# Altium schematic sheet CVTOP.SchDoc
size A3
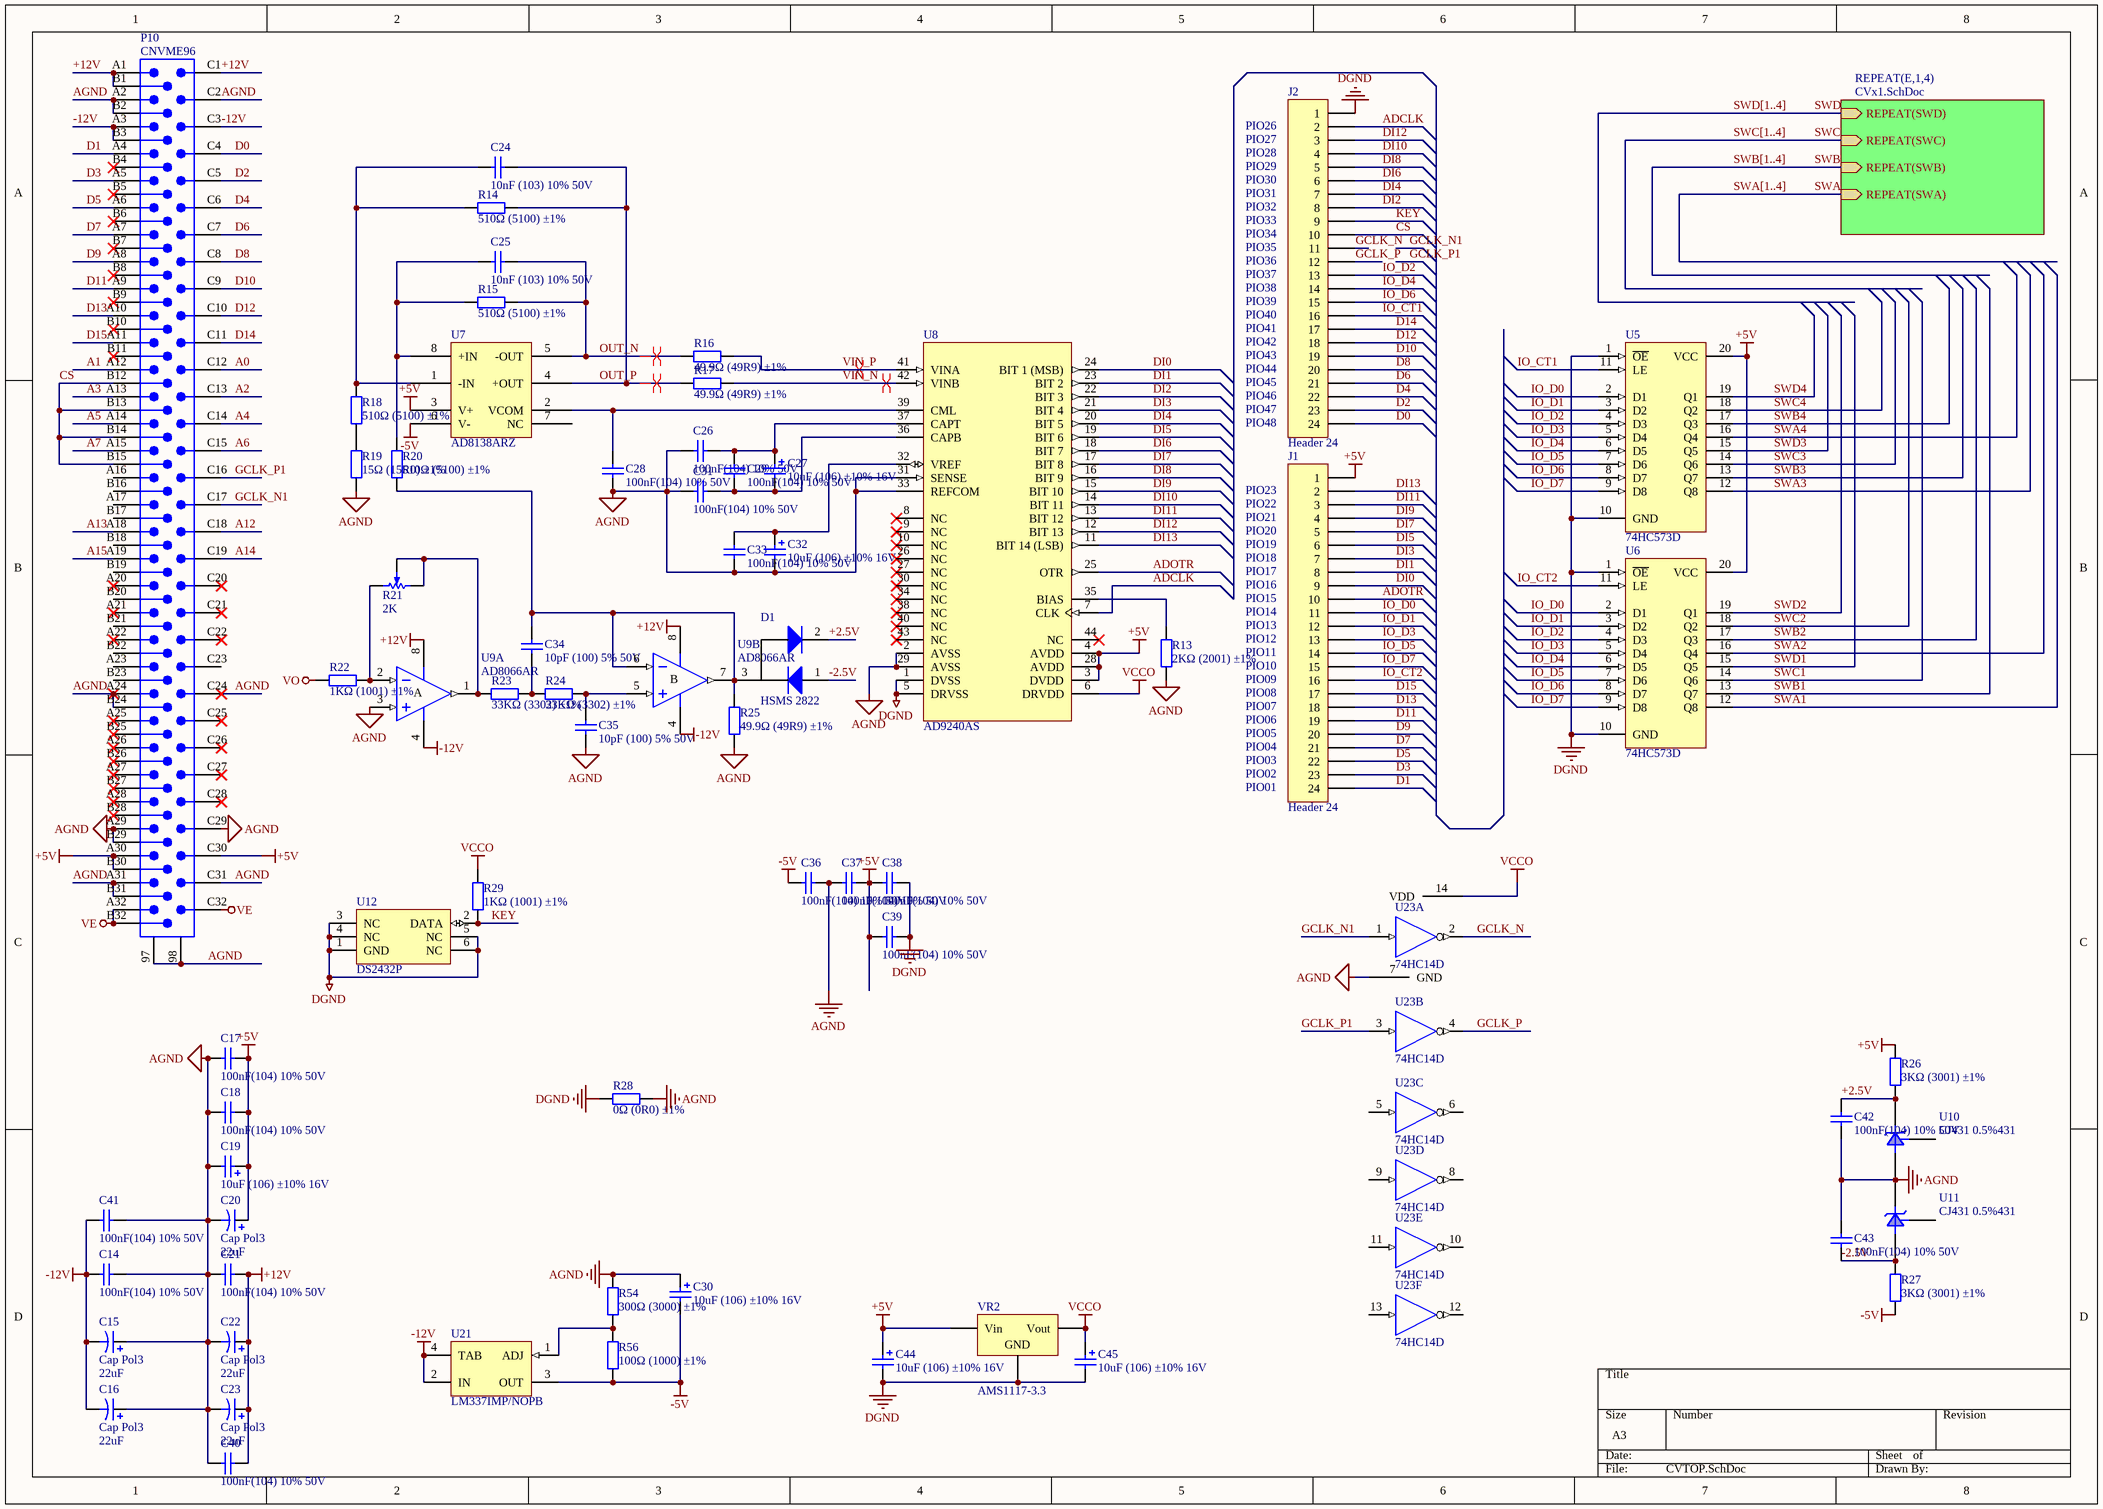
[diagram p0: CVTOP.SchDoc]

## Parts
C14  100nF(104) 10% 50V  [LC-0805_C]
C15  Cap Pol3  value 22uF  [C2225]
C16  Cap Pol3  value 22uF  [C2225]
C17  100nF(104) 10% 50V  [LC-0805_C]
C18  100nF(104) 10% 50V  [LC-0805_C]
C19  10uF (106) ±10% 16V  [LC-CASE-A_3216]
C20  Cap Pol3  value 22uF  [C2225]
C21  100nF(104) 10% 50V  [LC-0805_C]
C22  Cap Pol3  value 22uF  [C2225]
C23  Cap Pol3  value 22uF  [C2225]
C24  10nF (103) 10% 50V  [LC-0805_C]
C25  10nF (103) 10% 50V  [LC-0805_C]
C26  100nF(104) 10% 50V  [LC-0805_C]
C27  10uF (106) ±10% 16V  [LC-CASE-A_3216]
C28  100nF(104) 10% 50V  [LC-0805_C]
C29  100nF(104) 10% 50V  [LC-0805_C]
C30  10uF (106) ±10% 16V  [LC-CASE-A_3216]
C31  100nF(104) 10% 50V  [LC-0805_C]
C32  10uF (106) ±10% 16V  [LC-CASE-A_3216]
C33  100nF(104) 10% 50V  [LC-0805_C]
C34  10pF (100) 5% 50V  [LC-0805_C]
C35  10pF (100) 5% 50V  [LC-0805_C]
C36  100nF(104) 10% 50V  [LC-0805_C]
C37  100nF(104) 10% 50V  [LC-0805_C]
C38  100nF(104) 10% 50V  [LC-0805_C]
C39  100nF(104) 10% 50V  [LC-0805_C]
C40  100nF(104) 10% 50V  [LC-0805_C]
C41  100nF(104) 10% 50V  [LC-0805_C]
C42  100nF(104) 10% 50V  [LC-0805_C]
C43  100nF(104) 10% 50V  [LC-0805_C]
C44  10uF (106) ±10% 16V  [LC-CASE-A_3216]
C45  10uF (106) ±10% 16V  [LC-CASE-A_3216]
D1  HSMS 2822  [LC-SOT-23(SOT-23-3)]
J1  Header 24  [HDR1X24]
J2  Header 24  [HDR1X24]
P10  CNVME96  [CNVME96]
R13  2KΩ (2001) ±1%  [LC-0805_R]
R14  510Ω (5100) ±1%  [LC-0805_R]
R15  510Ω (5100) ±1%  [LC-0805_R]
R16  49.9Ω (49R9) ±1%  [LC-0805_R]
R17  49.9Ω (49R9) ±1%  [LC-0805_R]
R18  510Ω (5100) ±1%  [LC-0805_R]
R19  15Ω (15R0) ±1%  [LC-0805_R]
R20  510Ω (5100) ±1%  [LC-0805_R]
R21  2K  [POT4MM-2]
R22  1KΩ (1001) ±1%  [LC-0805_R]
R23  33KΩ (3302) ±1%  [LC-0805_R]
R24  33KΩ (3302) ±1%  [LC-0805_R]
R25  49.9Ω (49R9) ±1%  [LC-0805_R]
R26  3KΩ (3001) ±1%  [LC-0805_R]
R27  3KΩ (3001) ±1%  [LC-0805_R]
R28  0Ω (0R0) ±1%  [LC-0805_R]
R29  1KΩ (1001) ±1%  [LC-0805_R]
R54  300Ω (3000) ±1%  [LC-0805_R]
R56  100Ω (1000) ±1%  [LC-0805_R]
U5  74HC573D  [LC-SOIC-20_300mil]
U6  74HC573D  [LC-SOIC-20_300mil]
U7  AD8138ARZ  [SO-8_N]
U8  AD9240AS  [S-44-MQFP_N]
U9  AD8066AR  [SO-8_N]  (parts A,B of 2)
U10  CJ431 0.5%431  [LC-SOT-23(SOT-23-3)]
U11  CJ431 0.5%431  [LC-SOT-23(SOT-23-3)]
U12  DS2432P  [TSOC6]
U21  LM337IMP/NOPB  [MP04A_N]
U23  74HC14D  [LC-SOIC-14_150mil]  (parts A,B,C,D,E,F of 6)
VR2  AMS1117-3.3  [LC-SOT-223]

## Sub-sheets
REPEAT(E,1,4) = CVx1.SchDoc: REPEAT(SWC) (in), REPEAT(SWB) (in), REPEAT(SWD) (in), REPEAT(SWA) (in)

## Nets
+5V: C17.2 C18.2 C19.1 C20.1 C37.1 C38.2 C39.2 C44.1 J1.1 P10.A30 P10.B30 P10.C30 R26.2 U5.20(VCC) U6.20(VCC) U7.3(V+) U8.3(DVDD) U8.4(AVDD) U8.28(AVDD) VR2.3(Vin)
+12V: C21.2 C22.1 C23.1 C40.1 P10.A1 P10.B1 P10.C1 U9.8(V+)
-5V: C30.2 C36.2 R27.1 R56.1 U7.6(V-) U21.3(OUT)
-12V: C14.1 C15.2 C16.2 C41.2 P10.A3 P10.B3 P10.C3 U9.4(V-) U21.2(IN) U21.4(TAB)
AGND: C14.2 C15.1 C16.1 C17.1 C18.1 C19.2 C20.2 C21.1 C22.2 C23.2 C26.2 C28.1 C30.1 C31.2 C32.2 C33.1 C35.1 C36.1 C37.2 C40.2 C41.1 C42.2 C43.1 P10.97 P10.98 P10.A2 P10.A24 P10.A29 P10.A31 P10.B2 P10.B24 P10.B29 P10.B31 P10.C2 P10.C24 P10.C29 P10.C31 R13.1 R19.1 R25.1 R28.2 R54.2 U8.2(AVSS) U8.29(AVSS) U8.31(SENSE) U8.33(REFCOM) U9.3(IN+) U10.3(A) U11.2(K) U23.7(GND)
DGND: C38.1 C39.1 C44.2 C45.2 J2.1 R28.1 U5.1(~{OE}) U5.10(GND) U6.1(~{OE}) U6.10(GND) U8.1(DVSS) U8.5(DRVSS) U12.1(GND) U12.3(NC) U12.4(NC) U12.5(NC) U12.6(NC) VR2.1(GND)
VCCO: C45.1 R29.2 U8.6(DRVDD) U23.14(VDD) VR2.2(Vout)
VE: P10.A32 P10.B32 P10.C32
VO: R22.1
+2.5V: C42.1 D1.2(A) R26.1 U10.2(K)
-2.5V: C43.2 D1.1(A) R27.2 U11.3(A)
A0: P10.C12
A1: P10.A12
A2: P10.C13
A3: P10.A13
A4: P10.C14
A5: P10.A14
A6: P10.C15
A7: P10.A15
A12: P10.C18
A13: P10.A18
A14: P10.C19
A15: P10.A19
ADCLK: J2.2 U8.7(CLK)
ADOTR: J1.10 U8.25(OTR)
CS: J2.10 P10.B12 P10.B13 P10.B14 P10.B15
D0: J2.24 P10.C4
D1: J1.24 P10.A4
D2: J2.23 P10.C5
D3: J1.23 P10.A5
D4: J2.22 P10.C6
D5: J1.22 P10.A6
D6: J2.21 P10.C7
D7: J1.21 P10.A7
D8: J2.20 P10.C8
D9: J1.20 P10.A8
D10: J2.19 P10.C9
D11: J1.19 P10.A9
D12: J2.18 P10.C10
D13: J1.18 P10.A10
D14: J2.17 P10.C11
D15: J1.17 P10.A11
DI0: J1.9 U8.24(BIT_1_(MSB))
DI1: J1.8 U8.23(BIT_2)
DI2: J2.8 U8.22(BIT_3)
DI3: J1.7 U8.21(BIT_4)
DI4: J2.7 U8.20(BIT_5)
DI5: J1.6 U8.19(BIT_6)
DI6: J2.6 U8.18(BIT_7)
DI7: J1.5 U8.17(BIT_8)
DI8: J2.5 U8.16(BIT_9)
DI9: J1.4 U8.15(BIT_10)
DI10: J2.4 U8.14(BIT_11)
DI11: J1.3 U8.13(BIT_12)
DI12: J2.3 U8.12(BIT_13)
DI13: J1.2 U8.11(BIT_14_(LSB))
GCLK_N: J2.11 U23.2(Y)
GCLK_N1: P10.C17 U23.1(A)
GCLK_P: J2.12 U23.4(Y)
GCLK_P1: P10.C16 U23.3(A)
IO_CT1: J2.16 U5.11(LE)
IO_CT2: J1.16 U6.11(LE)
IO_D0: J1.11 U5.2(D1) U6.2(D1)
IO_D1: J1.12 U5.3(D2) U6.3(D2)
IO_D2: J2.13 U5.4(D3) U6.4(D3)
IO_D3: J1.13 U5.5(D4) U6.5(D4)
IO_D4: J2.14 U5.6(D5) U6.6(D5)
IO_D5: J1.14 U5.7(D6) U6.7(D6)
IO_D6: J2.15 U5.8(D7) U6.8(D7)
IO_D7: J1.15 U5.9(D8) U6.9(D8)
KEY: J2.9 R29.1 U12.2(DATA)
OUT_N: C25.2 R15.2 R16.1 U7.5(-OUT)
OUT_P: C24.2 R14.2 R17.1 U7.4(+OUT)
SWA: sheet REPEAT(E,1,4)/REPEAT(SWA)
SWA1: U6.12(Q8)
SWA2: U6.16(Q4)
SWA3: U5.12(Q8)
SWA4: U5.16(Q4)
SWB: sheet REPEAT(E,1,4)/REPEAT(SWB)
SWB1: U6.13(Q7)
SWB2: U6.17(Q3)
SWB3: U5.13(Q7)
SWB4: U5.17(Q3)
SWC: sheet REPEAT(E,1,4)/REPEAT(SWC)
SWC1: U6.14(Q6)
SWC2: U6.18(Q2)
SWC3: U5.14(Q6)
SWC4: U5.18(Q2)
SWD: sheet REPEAT(E,1,4)/REPEAT(SWD)
SWD1: U6.15(Q5)
SWD2: U6.19(Q1)
SWD3: U5.15(Q5)
SWD4: U5.19(Q1)
VIN_N: R17.2 U8.42(VINB)
VIN_P: R16.2 U8.41(VINA)
NetC24_1: C24.1 R14.1 R18.2 U7.1(-IN)
NetC25_1: C25.1 R15.1 R20.2 U7.8(+IN)
NetC26_1: C26.1 C27.1 C29.2 U8.37(CAPT)
NetC27_2: C27.2 C29.1 C31.1 U8.36(CAPB)
NetC28_2: C28.2 U7.2(VCOM) U8.39(CML)
NetC32_1: C32.1 C33.2 U8.32(VREF)
NetC34_1: C34.1 R23.2 R24.1
NetC34_2: C34.2 D1.3(K) R20.1 R25.2 U9.6(IN-) U9.7(OUT)
NetC35_2: C35.2 R24.2 U9.5(IN+)
NetR13_2: R13.2 U8.35(BIAS)
NetR18_1: R18.1 R19.2
NetR21_CCW: R21.CCW(-) R21.W R23.1 U9.1(OUT)
NetR21_CW: R21.CW(+) R22.2 U9.2(IN-)
NetR54_1: R54.1 R56.2 U21.1(ADJ)

Not connected (* = marked no-connect by the designer): P10 A16 A17 A20* A21* A22* A23 A25* A26* A27* A28* B4* B5* B6* B7* B8* B9* B10* B11* B16 B17 B18 B19 B20 B21 B22 B23 B25* B26* B27* B28* C20* C21* C22* C23 C25* C26* C27* C28*; U7 7(NC); U8 8(NC)* 9(NC)* 10(NC)* 26(NC)* 27(NC)* 30(NC)* 34(NC)* 38(NC)* 40(NC)* 43(NC)* 44(NC)*; U10 1(R); U11 1(R); U23 5(A) 6(Y) 8(Y) 9(A) 10(Y) 11(A) 12(Y) 13(A)

## Buses and harness runs
bus SWA[1..4]
bus SWB[1..4]
bus SWC[1..4]
bus SWD[1..4]

## Layout directives
differential pair: OUT_N, OUT_P, VIN_N, VIN_P

## Notes on the sheet
- (near J2) PIO30
- (near J2) PIO29
- (near J2) PIO28
- (near J2) PIO27
- (near J2) PIO26
- (near J2) PIO34
- (near J2) PIO33
- (near J2) PIO32
- (near J2) PIO31
- (near J2) PIO40
- (near J2) PIO39
- (near J2) PIO38
- (near J2) PIO37
- (near J2) PIO36
- (near J2) PIO35
- (near J2) PIO44
- (near J2) PIO43
- (near J2) PIO42
- (near J2) PIO41
- PIO48
- PIO47
- (near J2) PIO46
- (near J2) PIO45
- (near J1) PIO22
- PIO23
- (near J1) PIO16
- (near J1) PIO17
- (near J1) PIO18
- (near J1) PIO19
- (near J1) PIO20
- (near J1) PIO21
- PIO12
- PIO13
- PIO14
- (near J1) PIO15
- (near J1) PIO06
- (near J1) PIO07
- PIO08
- PIO09
- PIO10
- PIO11
- (near J1) PIO02
- (near J1) PIO03
- (near J1) PIO04
- (near J1) PIO05
- (near J1) PIO01
- (in symbol AD8056AR, part A) A
- (in symbol AD8056AR, part B) B

## Library data of the parts
C14 C17 C18 C21 C26 C28 C29 C31 C33 C36-C43 = 0805 100nF(104) 10% 50V: 贴片电容; ComponentLink1Description: 供应商链接; ComponentLink1URL: http://www.szlcsc.com/product/details_50686.html; Package: 0805; Supplier: LC; SuppliersPartNumber: C49678
C15 C16 C20 C22 C23 = Cap Pol3: Polarized Capacitor (Surface Mount); Published: 8-Jun-2000; LatestRevisionDate: 29-May-2009; LatestRevisionNote: IPC-7351 Footprint Added.; PackageReference: C0805; Publisher: Altium Limited; PackageDescription: Chip Capacitor
C19 C27 C30 C32 C44 C45 = 3216 10uF (106) 10% 16V: 钽电容; ComponentLink1Description: 供应商链接; ComponentLink1URL: http://www.szlcsc.com/product/details_7643.html; Package: 3216; Supplier: LC; SuppliersPartNumber: C7171
C24 C25 = 0805 10nF (103) 10% 50V: 贴片电容; ComponentLink1Description: 供应商链接; ComponentLink1URL: http://www.szlcsc.com/product/details_2062.html; Package: 0805; Supplier: LC; SuppliersPartNumber: C1710
C34 C35 = 0805 10pF (100) 5% 50V: 贴片电容; ComponentLink1Description: 供应商链接; ComponentLink1URL: http://www.szlcsc.com/product/details_2137.html; Package: 0805; Supplier: LC; SuppliersPartNumber: C1785
D1 = SOT-23 BAV99 A7W: 开关二极管; ComponentLink1Description: 供应商链接; ComponentLink1URL: http://www.szlcsc.com/product/details_2877.html; Package: SOT-23; Supplier: LC; SuppliersPartNumber: C2500
J1 J2 = Header 24: Header, 24-Pin; LatestRevisionDate: 17-Jul-2002; LatestRevisionNote: Re-released for DXP Platform.; Publisher: Altium Limited
P10 = CNVME96: 96-Pin Connector (3x32 2.54mm grid); Text Field6: Alternate Layout Available; Text Field7: Published 14-Feb-2002
R13 = 0805 2KΩ (2001) 1%: 贴片电阻; ComponentLink1Description: 供应商链接; ComponentLink1URL: http://www.szlcsc.com/product/details_18292.html; Package: 0805; Supplier: LC; SuppliersPartNumber: C17604
R14 R15 R18 R20 = 0805 510Ω (5100) 1%: 贴片电阻; ComponentLink1Description: 供应商链接; ComponentLink1URL: http://www.szlcsc.com/product/details_18422.html; Package: 0805; Supplier: LC; SuppliersPartNumber: C17734
R16 R17 R25 = 0805 49.9Ω (49R9) 1%: 贴片电阻; ComponentLink1Description: 供应商链接; ComponentLink1URL: http://www.szlcsc.com/product/details_18408.html; Package: 0805; Supplier: LC; SuppliersPartNumber: C17720
R19 = 0805 15Ω (15R0) 1%: 贴片电阻; ComponentLink1Description: 供应商链接; ComponentLink1URL: http://www.szlcsc.com/product/details_18168.html; Package: 0805; Supplier: LC; SuppliersPartNumber: C17480
R21 = RPot SM: Square Trimming Potentiometer; Published: 17-Dec-2003; DatasheetVersion: Oct-2003; PackageReference: POT4MM-2; Publisher: Altium Limited; PackageDescription: Square Trimming Potentiometer; ComponentLink1Description: Manufacturer Link; ComponentLink1URL: http://bourns.com/2/search.html
R22 R29 = 0805 1KΩ (1001) 1%: 贴片电阻; ComponentLink1Description: 供应商链接; ComponentLink1URL: http://www.szlcsc.com/product/details_18201.html; Package: 0805; Supplier: LC; SuppliersPartNumber: C17513
R23 R24 = 0805 33KΩ (3302) 1%: 贴片电阻; ComponentLink1Description: 供应商链接; ComponentLink1URL: http://www.szlcsc.com/product/details_18321.html; Package: 0805; Supplier: LC; SuppliersPartNumber: C17633
R26 R27 = 0805 3KΩ (3001) 1%: 贴片电阻; ComponentLink1Description: 供应商链接; ComponentLink1URL: http://www.szlcsc.com/product/details_18349.html; Package: 0805; Supplier: LC; SuppliersPartNumber: C17661
R28 = 0805 0Ω (0R0) 1%: 贴片电阻; ComponentLink1Description: 供应商链接; ComponentLink1URL: http://www.szlcsc.com/product/details_18165.html; Package: 0805; Supplier: LC; SuppliersPartNumber: C17477
R54 = 0805 300Ω (3000) 1%: 贴片电阻; ComponentLink1Description: 供应商链接; ComponentLink1URL: http://www.szlcsc.com/product/details_18305.html; Package: 0805; Supplier: LC; SuppliersPartNumber: C17617
R56 = 0805 100Ω (1000) 1%: 贴片电阻; ComponentLink1Description: 供应商链接; ComponentLink1URL: http://www.szlcsc.com/product/details_18096.html; Package: 0805; Supplier: LC; SuppliersPartNumber: C17408
U5 U6 = 74HC573D: 74系列逻辑芯片; ComponentLink1Description: 供应商链接; ComponentLink1URL: http://www.szlcsc.com/product/details_6059.html; Package: SOIC-20_300mil; Supplier: LC; SuppliersPartNumber: C5608
U8 = AD9240AS: Complete 14-Bit, 10 MSPS Monolithic A/D Converter, 44-Pin MQFP, Industrial; Published: 26-May-2004; LatestRevisionDate: 13-Apr-2006; LatestRevisionNote: IPC-7351 Footprint Added.; DatasheetVersion: Rev. A; PackageVersion: Rev. A; PackageReference: S-44-MQFP; Publisher: Altium Limited; PackageDescription: 44-Pin Metric Quad Flat Pack 0.8 mm Pitch; Code_IPC: QFP80P1320X1320-44; ComponentLink1Description: Manufacturer Link; ComponentLink1URL: http://www.analog.com/en/prod/0%2C2877%2CAD9240%2C00.html; ComponentLink2Description: Datasheet; ComponentLink2URL: http://www.analog.com/UploadedFiles/Data_Sheets/417954540AD9240_a.pdf
U9 = AD8056AR: Low Cost, 300MHz Voltage Feedback Amplifier; Published: 8-Jun-2000; LatestRevisionDate: 13-Apr-2006; LatestRevisionNote: IPC-7351 Footprint Added.; DatasheetVersion: REV. 0 1997; PackageVersion: revA; PackageReference: SO-8; Publisher: Altium Limited; PackageDescription: 8-Pin Small Outline Integrated Circuit 1.27 mm Pitch; Code_JEDEC: MS-012-AA; Code_IPC: SOIC127P600-8; ComponentLink1Description: Manufacturer Link; ComponentLink1URL: http://www.analog.com/en/prod/0,,759_786_AD8055%2C00.html; ComponentLink2Description: Datasheet; ComponentLink2URL: http://www.analog.com/UploadedFiles/Data_Sheets/40402558757264AD8055_6_i.pdf
U10 U11 = CJ431 0.5%431: 电压基准; ComponentLink1Description: 供应商链接; ComponentLink1URL: http://www.szlcsc.com/product/details_3500.html; Package: SOT-23; Supplier: LC; SuppliersPartNumber: C3113
U12 = DS2430AP: 256-Bit 1-Wire EEPROM; Note: Pin numbers 3-6 are Not Connected (NC); Published: 13-Oct-2000; LatestRevisionDate: 17-Jul-2002; LatestRevisionNote: Re-released for DXP Platform.; DatasheetVersion: 21-Oct-1999; PackageVersion: 1999; PackageReference: TSOC6; Publisher: Altium Limited; PackageDescription: Small Outline; 6 C-Bend Leads; Body Width 3.8 mm; Pitch 1.27 mm; ComponentLink1Description: Manufacturer Link; ComponentLink1URL: http://www.maxim-ic.com/; ComponentLink2Description: Datasheet; ComponentLink2URL: http://pdfserv.maxim-ic.com/en/ds/DS2430A.pdf
U21 = LM337IMP/NOPB: 3-Terminal Adjustable Negative Regulator, 4-pin SOT-223, Pb-Free; Manufacturer: National Semiconductor; PackageTopMarking: XYTT*N02A; PowerWise: N; CompType: LDO IC; Published: 1-Mar-2010; DatasheetVersion: Nov-2004; PackageVersion: revB, Apr-2003; PackageReference: MP04A; Publisher: Altium Limited; PackageDescription: Molded SOT-223, 6.50 x 3.56 x 1.6mm Body, 4 Lead, 2.3mm Pitch; Supplier 1: Digi-Key; Supplier Part Number 1: LM337IMPTR-ND; Supplier 2: Digi-Key; Supplier Part Number 2: LM337IMPCT-ND; Supplier 3: Digi-Key; Supplier Part Number 3: LM337IMPDKR-ND; Supplier 4: Newark; Supplier Part Number 4: 41K4742; PartNumber: LM337IMP/NOPB; RoHS: Y; PinCount: 4; Code_JEDEC: TO-261-AA; Code_IPC: SOT223-4; ComponentLink1Description: LM337 Datasheet; ComponentLink1URL: http://www.national.com/ds/LM/LM337.pdf; ComponentLink2Description: LM337 Web Page; ComponentLink2URL: http://www.national.com/pf/LM/LM337.html; ComponentLink3Description: MP04A Package Page; ComponentLink3URL: http://www.national.com/packaging/folders/mp04a.html
U23 = 74HC14D_[C5605]: 74系列逻辑芯片; ComponentLink1Description: 供应商链接; ComponentLink1URL: http://www.szlcsc.com/product/details_6056.html; Package: SOIC-14_150mil; Supplier: LC; SuppliersPartNumber: C5605
VR2 = SOT-223 AMS1117-3.3: 低压差线性稳压(LDO); ComponentLink1Description: 供应商链接; ComponentLink1URL: http://www.szlcsc.com/product/details_6652.html; Package: SOT-223; Supplier: LC; SuppliersPartNumber: C6186